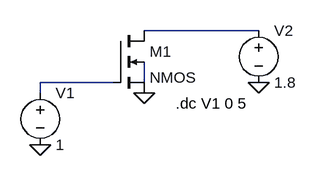
[diagram p0: schematic NMOS_IV.asc]
NMOS_IV.asc, the LTspice schematic file:
Version 4
SHEET 1 880 680
WIRE 368 112 192 112
WIRE 144 192 32 192
WIRE 192 192 192 160
WIRE 32 208 32 192
FLAG 368 192 0
FLAG 32 288 0
FLAG 192 208 0
SYMBOL nmos4 144 112 R0
SYMATTR InstName M1
SYMATTR Value2 l=4u w=40u
SYMBOL voltage 32 192 R0
WINDOW 123 0 0 Left 0
WINDOW 39 0 0 Left 0
SYMATTR InstName V1
SYMATTR Value 1
SYMBOL voltage 368 96 R0
WINDOW 123 0 0 Left 0
WINDOW 39 0 0 Left 0
SYMATTR InstName V2
SYMATTR Value 1.8
TEXT 240 224 Left 2 !.dc V1 0 5

The netlist it stands for:
* NMOS_IV.asc
M1 N001 N002 0 N003 NMOS l=4u w=40u
V1 N002 0 1
V2 N001 0 1.8
.model NMOS NMOS
.model PMOS PMOS
.lib standard.mos
.dc V1 0 5
.backanno
.end